# EAGLE design doorbell (EAGLE 6.6.0)
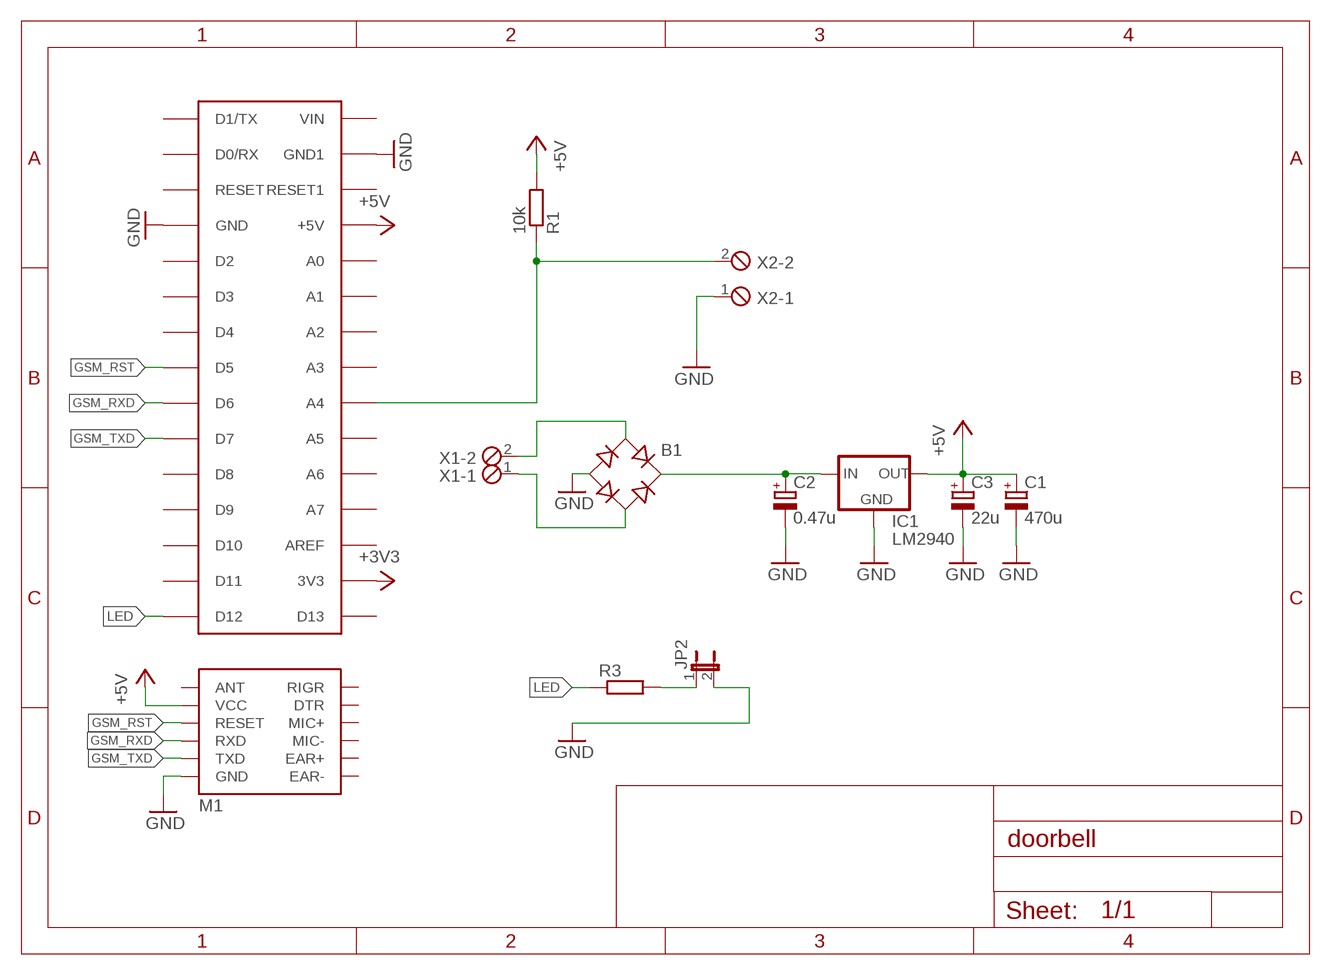
[diagram p0: schematic, sheet 1]

## Parts
B1  RB1A  [RB1A]
C1  470u  CPOL-EUE2.5-6  [E2,5-6]
C2  0.47u  CPOL-EUE2.5-5  [E2,5-5]
C3  22u  CPOL-EUE2.5-5  [E2,5-5]
IC1  LM2940  78XXS  [78XXS]
JP2  JP1E  [JP1]
M1  SIM800L  [SIM800L]
R1  10k  R-EU_0207/10  [0207/10]
R3  R-EU_0309/V  [0309V]
U$1  ARDUINONANO  [PDIP-32]
X1  MPT2  [2POL254]
X2  MPT2  [2POL254]

## Nets
+3V3: U$1.3V3
+5V: C1.+ C3.+ IC1.OUT M1.VCC R1.2 U$1.+5V
GND: B1.- C1.- C2.- C3.- IC1.GND JP2.2 M1.GND U$1.GND U$1.GND1 X2.1
GSM_RST: M1.RESET U$1.D5
GSM_RXD: M1.RXD U$1.D6
GSM_TXD: M1.TXD U$1.D7
INPUT: R1.1 U$1.A4 X2.2
LED: R3.1 U$1.D12
N$2: B1.AC1 X1.2
N$3: B1.AC2 X1.1
N$5: B1.+ C2.+ IC1.IN
N$82: JP2.1 R3.2
Unconnected: M1.ANT M1.DTR M1.EAR+ M1.EAR- M1.MIC+ M1.MIC- M1.RIGR U$1.A0 U$1.A1 U$1.A2 U$1.A3 U$1.A5 U$1.A6 U$1.A7 U$1.AREF U$1.D0/RX U$1.D1/TX U$1.D2 U$1.D3 U$1.D4 U$1.D8 U$1.D9 U$1.D10 U$1.D11 U$1.D13 U$1.RESET U$1.RESET1 U$1.VIN

## Library data of the parts
B1 = rectifier:RB1A: RECTIFIER 1 A
C1-C3 = rcl:CPOL-EU: POLARIZED CAPACITOR, European symbol
IC1 = v-reg:78XXS: VOLTAGE REGULATOR
JP2 = jumper:JP1E: JUMPER
M1 = library:SIM800L
R1 R3 = rcl:R-EU_: RESISTOR, European symbol
U$1 = rocketfarm:ARDUINONANO
X1 X2 = con-phoenix-254:MPT2: PHOENIX CONNECTOR; OC_FARNELL: unknown; OC_NEWARK: unknown

## Board
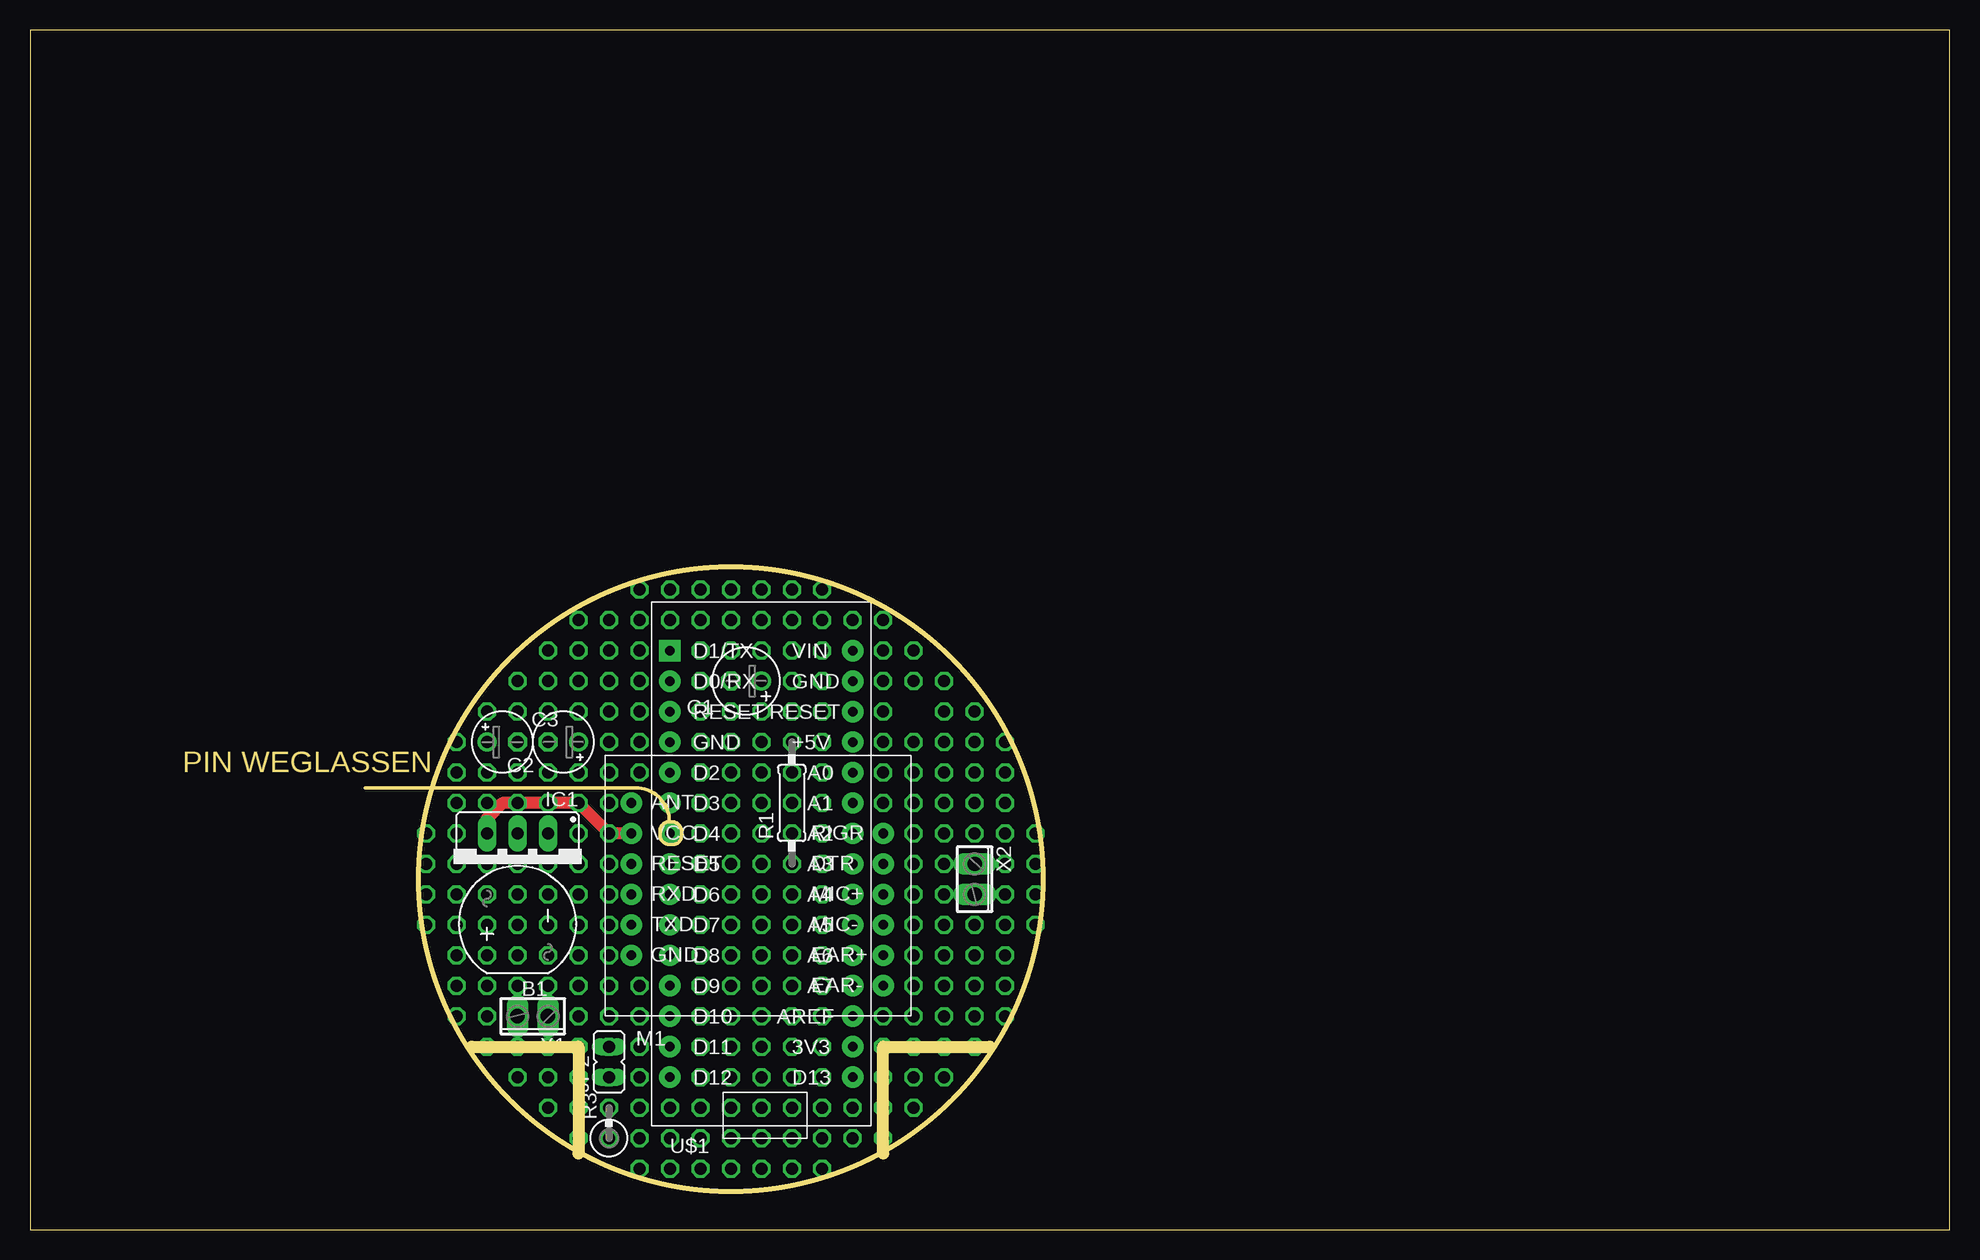
[diagram p1: board, top side]
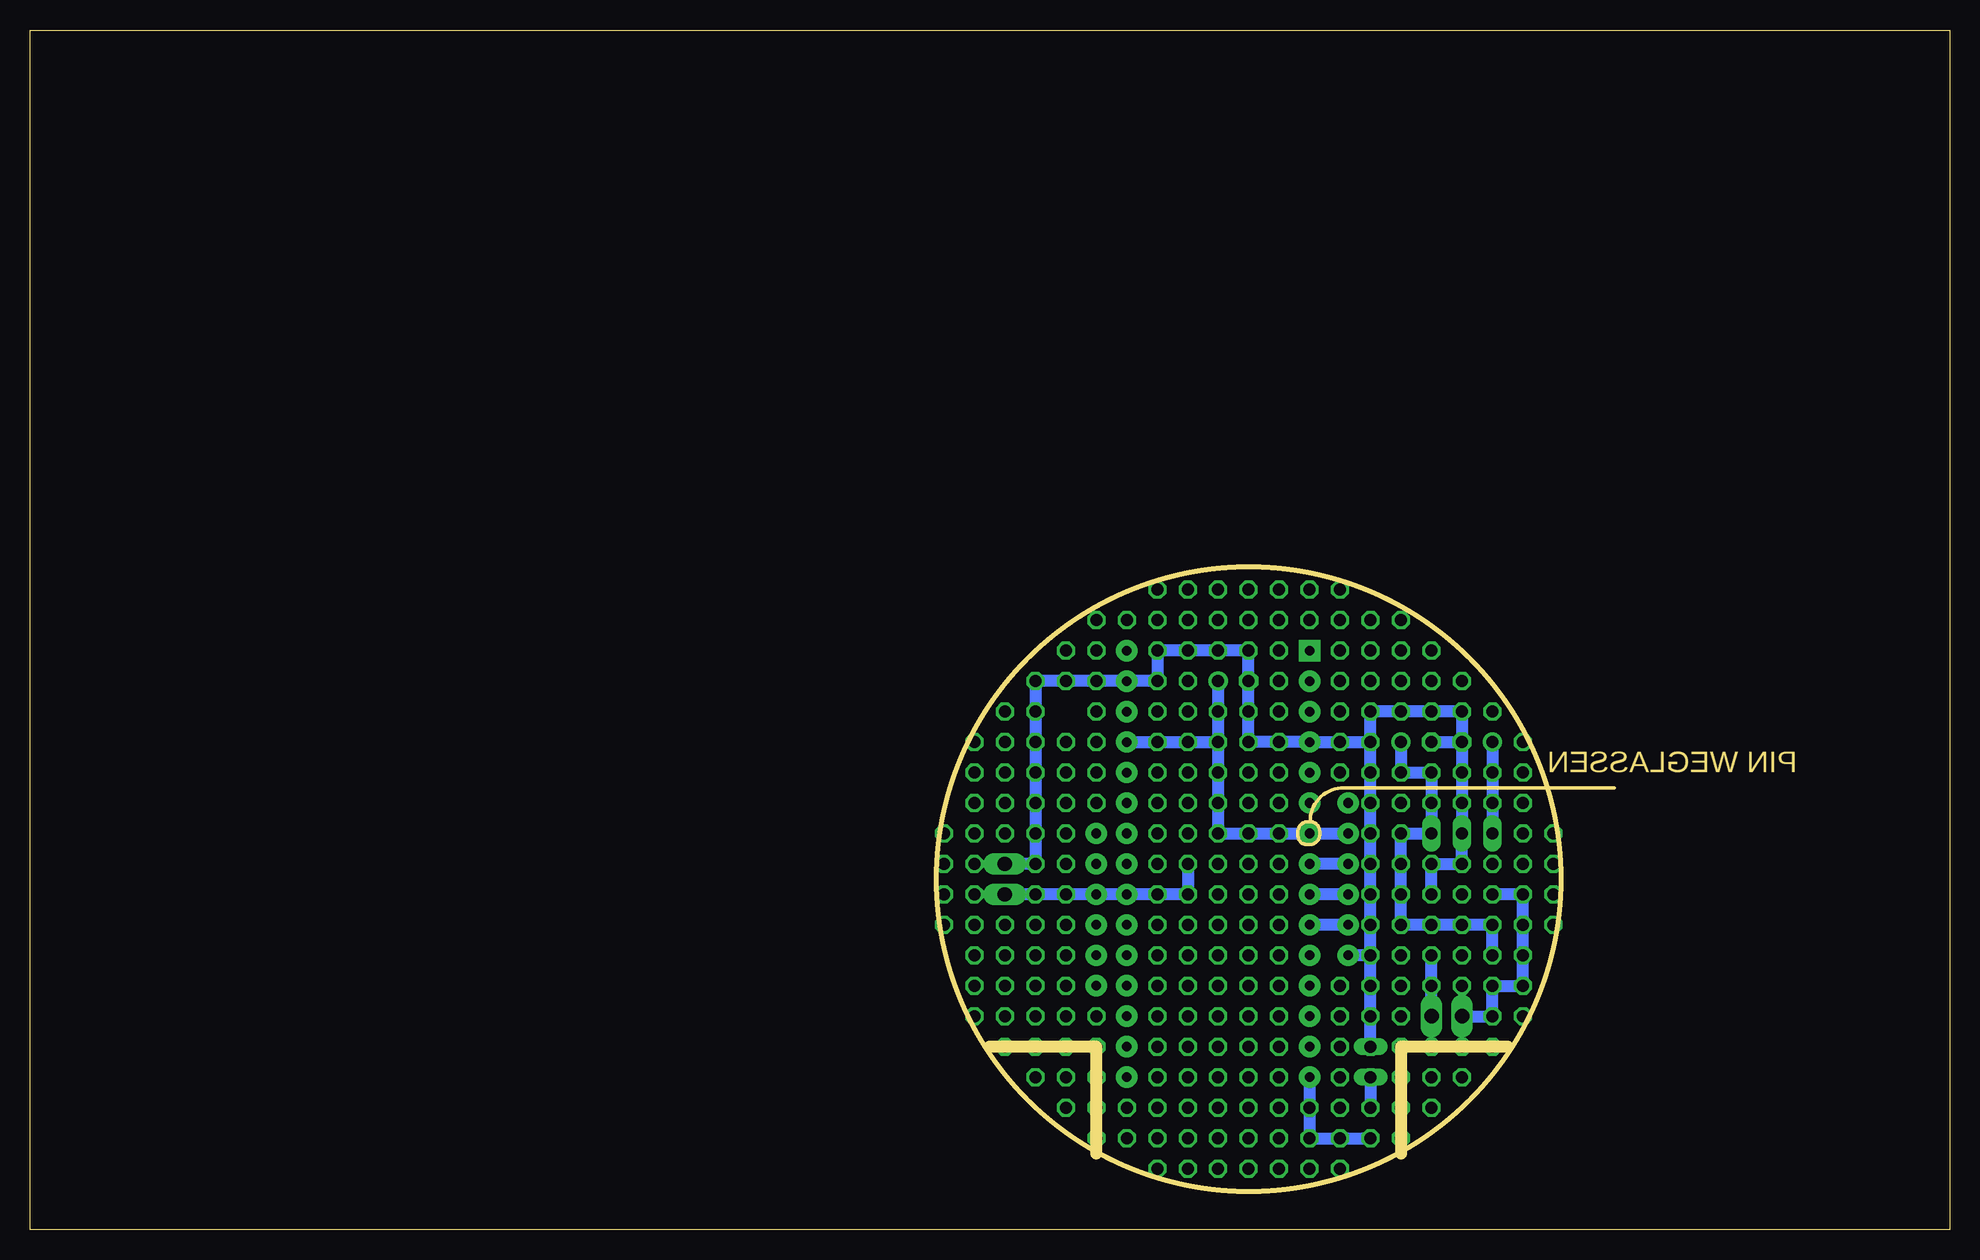
[diagram p2: board, bottom side, seen from below]

Size 160 x 100 mm. Coordinates in mm from the lower left corner, seen from the top.
Outline: 36.83,15.24 45.72,15.24 45.72,6.35
Outline: 71.12,6.35 71.12,15.24 80.01,15.24
Outline: 27.94,36.83 50.47,36.83 arc-90 53.3,34
Outline: 53.3,34 53.5,34 arc-90 54.3,33.2 54.3,32.8 arc-90 53.6,32.1 53.3,32.1 arc-90 52.5,32.9 52.5,33.2 arc-90 53.3,34
Outline: 0,0 160,0 160,100 0,100 0,0
Outline: circle at 58.42,29.21 radius 26.04
Copper layers (1*16): Top 0.035mm / dielectric 1.5mm / Bottom 0.035mm
Design rules "default": minimum track width 10mil, minimum drill 24mil, track to track 8mil, track to pad 8mil, pad to pad 8mil, via to via 8mil, smd to smd 8mil, copper to edge 40mil, drill to drill 8mil, minimum pad ring 10mil, minimum via ring 8mil, stop-mask expansion 4mil, vias tented up to drill 0mil, thermal gap 10mil

### Footprints (pad centres in the part's own frame; a part is rotated, then mirrored left to right if it is on the bottom)
RB1A = drill 1.016: + -2.54,2.54 | drill 1.016 octagon: - 2.54,-2.54; AC1 2.54,2.54; AC2 -2.54,-2.54
E2,5-6 = drill 0.813 pad 1.6: + -1.27,0 | drill 0.813 pad 1.6 octagon: - 1.27,0
E2,5-5 = drill 0.813 pad 1.6: + -1.27,0 | drill 0.813 pad 1.6 octagon: - 1.27,0
78XXS = drill 1.016 long: GND 0,-2.54; IN -2.54,-2.54; OUT 2.54,-2.54
JP1 = drill 0.914 long: 1 0,-1.27; 2 0,1.27
SIM800L = drill 0.8 pad 1.778: ANT -10.5,7.54; DTR 10.5,2.46; EAR+ 10.5,-5.16; EAR- 10.5,-7.7; GND -10.5,-5.16; MIC+ 10.5,-0.08; MIC- 10.5,-2.62; RESET -10.5,2.46; RIGR 10.5,5; RXD -10.5,-0.08; TXD -10.5,-2.62; VCC -10.5,5
0207/10 = drill 0.813 octagon: 1 -5.08,0; 2 5.08,0
0309V = drill 0.813 octagon: 1 -1.27,0; 2 1.27,0
PDIP-32 = drill 0.8 pad 1.778: 3V3 7.62,-15.24; +5V 7.62,10.16; A0 7.62,7.62; A1 7.62,5.08; A2 7.62,2.54; A3 7.62,0; A4 7.62,-2.54; A5 7.62,-5.08; A6 7.62,-7.62; A7 7.62,-10.16; AREF 7.62,-12.7; D0/RX -7.62,15.24; D2 -7.62,7.62; D3 -7.62,5.08; D4 -7.62,2.54; D5 -7.62,0; D6 -7.62,-2.54; D7 -7.62,-5.08; D8 -7.62,-7.62; D9 -7.62,-10.16; D10 -7.62,-12.7; D11 -7.62,-15.24; D12 -7.62,-17.78; D13 7.62,-17.78; GND -7.62,10.16; GND1 7.62,15.24; RESET -7.62,12.7; RESET1 7.62,12.7; VIN 7.62,17.78 | drill 0.8 pad 1.778 square: D1/TX -7.62,17.78
2POL254 = drill 1.2 long: 1 -1.27,0; 2 1.27,0

### Placement (x,y rotation side)
B1  40.64,25.4 90 top
C1  59.69,45.72 180 top
C2  44.45,40.64 180 top
C3  39.37,40.64 0 top
IC1  40.64,30.48 180 top
JP2  48.26,13.97 0 top
M1  60.63,28.02 0 top
R1  63.5,35.56 90 top
R3  48.26,8.89 90 top
U$1  60.96,30.48 0 top
X1  41.91,17.78 180 top
X2  78.74,29.21 270 top

### Tracks (layer width: path | path; a pad name or v marks a point on that pad's centre or on a via)
+5V  (via drill 1)
  Top 1.016: IC1.OUT 38.1,34.29 39.37,35.56 45.72,35.56 v48.26,33.02 M1.VCC
  Bottom 1.016: C3.+ IC1.OUT | C1.+ 60.96,40.64 | 60.96,40.64 60.96,33.02 v55.88,33.02 M1.VCC | 60.96,40.64 R1.2 U$1.+5V
GND
  Bottom 1.016: 48.26,22.86 M1.GND | C3.- IC1.GND 40.64,30.48 43.18,30.48 B1.- | JP2.2 48.26,22.86 | 48.26,22.86 48.26,40.64 | 48.26,40.64 48.26,43.18 40.64,43.18 C3.- | C2.- C3.- | X2.1 76.2,30.48 76.2,45.72 U$1.GND1 66.04,45.72 66.04,48.26 58.42,48.26 C1.- 58.42,40.64 U$1.GND 48.26,40.64
GSM_RST
  Bottom 1.016: M1.RESET U$1.D5
GSM_RXD
  Bottom 1.016: M1.RXD U$1.D6
GSM_TXD
  Bottom 1.016: M1.TXD U$1.D7
INPUT
  Bottom 1.016: R1.1 63.5,27.94 U$1.A4 X2.2
LED
  Bottom 1.016: U$1.D12 53.34,7.62 R3.1
N$1  (via drill 1)
  other vias: 38.1,15.24
N$2
  Bottom 1.016: X1.2 38.1,17.78 38.1,20.32 35.56,20.32 35.56,27.94 B1.AC1
N$3
  Bottom 1.016: X1.1 B1.AC2
N$4  (via drill 1)
  other vias: 40.64,15.24
N$5
  Bottom 1.016: C2.+ 45.72,38.1 43.18,38.1 IC1.IN 45.72,33.02 45.72,25.4 38.1,25.4 B1.+
N$6  (via drill 1)
  other vias: 43.18,15.24
N$7  (via drill 1)
  other vias: 45.72,15.24
N$8  (via drill 1)
  other vias: 48.26,15.24
N$9  (via drill 1)
  other vias: 48.26,12.7
N$10  (via drill 1)
  other vias: 45.72,12.7
N$11  (via drill 1)
  other vias: 43.18,12.7
N$12  (via drill 1)
  other vias: 40.64,12.7
N$13  (via drill 1)
  other vias: 40.64,17.78
N$14  (via drill 1)
  other vias: 43.18,17.78
N$15  (via drill 1)
  other vias: 45.72,17.78
N$16  (via drill 1)
  other vias: 38.1,17.78
N$17  (via drill 1)
  other vias: 38.1,20.32
N$18  (via drill 1)
  other vias: 40.64,20.32
N$19  (via drill 1)
  other vias: 43.18,20.32
N$20  (via drill 1)
  other vias: 45.72,20.32
N$21  (via drill 1)
  other vias: 48.26,20.32
N$22  (via drill 1)
  other vias: 48.26,17.78
N$23  (via drill 1)
  other vias: 50.8,17.78
N$24  (via drill 1)
  other vias: 50.8,15.24
N$25  (via drill 1)
  other vias: 50.8,12.7
N$26  (via drill 1)
  other vias: 50.8,20.32
N$27  (via drill 1)
  other vias: 48.26,22.86
N$28  (via drill 1)
  other vias: 45.72,22.86
N$29  (via drill 1)
  other vias: 43.18,22.86
N$30  (via drill 1)
  other vias: 40.64,22.86
N$31  (via drill 1)
  other vias: 38.1,22.86
N$32  (via drill 1)
  other vias: 35.56,22.86
N$33  (via drill 1)
  other vias: 35.56,20.32
N$34  (via drill 1)
  other vias: 35.56,25.4
N$35  (via drill 1)
  other vias: 38.1,25.4
N$36  (via drill 1)
  other vias: 40.64,25.4
N$37  (via drill 1)
  other vias: 43.18,25.4
N$38  (via drill 1)
  other vias: 45.72,25.4
N$39  (via drill 1)
  other vias: 48.26,25.4
N$40  (via drill 1)
  other vias: 48.26,27.94
N$41  (via drill 1)
  other vias: 45.72,27.94
N$42  (via drill 1)
  other vias: 43.18,27.94
N$43  (via drill 1)
  other vias: 40.64,27.94
N$44  (via drill 1)
  other vias: 38.1,27.94
N$45  (via drill 1)
  other vias: 35.56,27.94
N$46  (via drill 1)
  other vias: 35.56,30.48
N$47  (via drill 1)
  other vias: 38.1,30.48
N$48  (via drill 1)
  other vias: 40.64,30.48
N$49  (via drill 1)
  other vias: 43.18,30.48
N$50  (via drill 1)
  other vias: 45.72,30.48
N$51  (via drill 1)
  other vias: 48.26,30.48
N$52  (via drill 1)
  other vias: 35.56,33.02
N$53  (via drill 1)
  other vias: 38.1,33.02
N$54  (via drill 1)
  other vias: 40.64,33.02
N$55  (via drill 1)
  other vias: 43.18,33.02
N$56  (via drill 1)
  other vias: 45.72,33.02
N$57  (via drill 1)
  other vias: 45.72,35.56
N$58  (via drill 1)
  other vias: 43.18,35.56
N$59  (via drill 1)
  other vias: 40.64,35.56
N$60  (via drill 1)
  other vias: 38.1,35.56
N$61  (via drill 1)
  other vias: 35.56,35.56
N$62  (via drill 1)
  other vias: 35.56,38.1
N$63  (via drill 1)
  other vias: 38.1,38.1
N$64  (via drill 1)
  other vias: 40.64,38.1
N$65  (via drill 1)
  other vias: 43.18,38.1
N$66  (via drill 1)
  other vias: 45.72,38.1
N$67  (via drill 1)
  other vias: 35.56,40.64
N$68  (via drill 1)
  other vias: 38.1,40.64
N$69  (via drill 1)
  other vias: 40.64,40.64
N$70  (via drill 1)
  other vias: 43.18,40.64
N$71  (via drill 1)
  other vias: 45.72,40.64
N$72  (via drill 1)
  other vias: 45.72,43.18
N$73  (via drill 1)
  other vias: 43.18,43.18
N$74  (via drill 1)
  other vias: 40.64,43.18
N$75  (via drill 1)
  other vias: 38.1,43.18
N$76  (via drill 1)
  other vias: 55.88,15.24
N$77  (via drill 1)
  other vias: 58.42,7.62
N$79  (via drill 1)
  other vias: 40.64,45.72
N$80  (via drill 1)
  other vias: 43.18,45.72
N$81  (via drill 1)
  other vias: 45.72,45.72
N$82
  Bottom 1.016: JP2.1 R3.2
N$83  (via drill 1)
  other vias: 43.18,48.26
N$84  (via drill 1)
  other vias: 45.72,48.26
N$85  (via drill 1)
  other vias: 48.26,48.26
N$86  (via drill 1)
  other vias: 50.8,48.26
N$87  (via drill 1)
  other vias: 50.8,50.8
N$88  (via drill 1)
  other vias: 48.26,50.8
N$89  (via drill 1)
  other vias: 45.72,50.8
N$96  (via drill 1)
  other vias: 50.8,53.34
N$97  (via drill 1)
  other vias: 53.34,50.8
N$98  (via drill 1)
  other vias: 55.88,50.8
N$99  (via drill 1)
  other vias: 58.42,50.8
N$100  (via drill 1)
  other vias: 60.96,50.8
N$101  (via drill 1)
  other vias: 63.5,50.8
N$102  (via drill 1)
  other vias: 63.5,53.34
N$103  (via drill 1)
  other vias: 60.96,53.34
N$104  (via drill 1)
  other vias: 58.42,53.34
N$105  (via drill 1)
  other vias: 55.88,53.34
N$106  (via drill 1)
  other vias: 53.34,53.34
N$113  (via drill 1)
  other vias: 78.74,15.24
N$114  (via drill 1)
  other vias: 76.2,15.24
N$115  (via drill 1)
  other vias: 73.66,15.24
N$116  (via drill 1)
  other vias: 71.12,15.24
N$117  (via drill 1)
  other vias: 71.12,12.7
N$118  (via drill 1)
  other vias: 73.66,12.7
N$119  (via drill 1)
  other vias: 76.2,12.7
N$121  (via drill 1)
  other vias: 78.74,17.78
N$122  (via drill 1)
  other vias: 76.2,17.78
N$123  (via drill 1)
  other vias: 73.66,17.78
N$124  (via drill 1)
  other vias: 81.28,17.78
N$125  (via drill 1)
  other vias: 81.28,20.32
N$126  (via drill 1)
  other vias: 78.74,20.32
N$127  (via drill 1)
  other vias: 76.2,20.32
N$128  (via drill 1)
  other vias: 73.66,20.32
N$130  (via drill 1)
  other vias: 71.12,17.78
N$132  (via drill 1)
  other vias: 73.66,22.86 73.66,25.4 76.2,25.4 73.66,38.1
N$133  (via drill 1)
  other vias: 76.2,22.86
N$134  (via drill 1)
  other vias: 78.74,22.86
N$135  (via drill 1)
  other vias: 81.28,22.86
N$138  (via drill 1)
  other vias: 83.82,25.4
N$139  (via drill 1)
  other vias: 81.28,25.4
N$140  (via drill 1)
  other vias: 78.74,25.4
N$145  (via drill 1)
  other vias: 73.66,27.94
N$146  (via drill 1)
  other vias: 76.2,27.94
N$147  (via drill 1)
  other vias: 78.74,27.94
N$148  (via drill 1)
  other vias: 81.28,27.94
N$149  (via drill 1)
  other vias: 83.82,27.94
N$150  (via drill 1)
  other vias: 83.82,30.48
N$151  (via drill 1)
  other vias: 81.28,30.48
N$152  (via drill 1)
  other vias: 78.74,30.48
N$153  (via drill 1)
  other vias: 76.2,30.48
N$154  (via drill 1)
  other vias: 73.66,30.48
N$156  (via drill 1)
  other vias: 83.82,33.02
N$157  (via drill 1)
  other vias: 81.28,33.02
N$158  (via drill 1)
  other vias: 78.74,33.02
N$159  (via drill 1)
  other vias: 76.2,33.02
N$160  (via drill 1)
  other vias: 73.66,33.02
N$161  (via drill 1)
  other vias: 73.66,35.56
N$162  (via drill 1)
  other vias: 76.2,35.56
N$163  (via drill 1)
  other vias: 78.74,35.56
N$164  (via drill 1)
  other vias: 81.28,35.56
N$167  (via drill 1)
  other vias: 81.28,38.1
N$168  (via drill 1)
  other vias: 78.74,38.1
N$169  (via drill 1)
  other vias: 76.2,38.1
N$172  (via drill 1)
  other vias: 81.28,40.64
N$173  (via drill 1)
  other vias: 78.74,40.64
N$174  (via drill 1)
  other vias: 76.2,40.64
N$175  (via drill 1)
  other vias: 73.66,40.64
N$177  (via drill 1)
  other vias: 76.2,43.18
N$178  (via drill 1)
  other vias: 78.74,43.18
N$184  (via drill 1)
  other vias: 76.2,45.72
N$185  (via drill 1)
  other vias: 73.66,45.72
N$188  (via drill 1)
  other vias: 73.66,48.26
N$189  (via drill 1)
  other vias: 71.12,48.26
N$190  (via drill 1)
  other vias: 71.12,50.8
N$198  (via drill 1)
  other vias: 71.12,35.56
N$199  (via drill 1)
  other vias: 71.12,38.1
N$200  (via drill 1)
  other vias: 71.12,40.64
N$201  (via drill 1)
  other vias: 71.12,45.72
N$202  (via drill 1)
  other vias: 71.12,43.18
N$203  (via drill 1)
  other vias: 50.8,45.72
N$204  (via drill 1)
  other vias: 48.26,45.72
N$205  (via drill 1)
  other vias: 48.26,43.18
N$206  (via drill 1)
  other vias: 50.8,43.18
N$207  (via drill 1)
  other vias: 50.8,40.64
N$208  (via drill 1)
  other vias: 48.26,40.64
N$209  (via drill 1)
  other vias: 48.26,38.1
N$210  (via drill 1)
  other vias: 50.8,38.1
N$211  (via drill 1)
  other vias: 48.26,35.56
N$213  (via drill 1)
  other vias: 66.04,53.34
N$215  (via drill 1)
  other vias: 68.58,50.8
N$216  (via drill 1)
  other vias: 66.04,50.8
N$217  (via drill 1)
  other vias: 71.12,10.16
N$218  (via drill 1)
  other vias: 73.66,10.16
N$219  (via drill 1)
  other vias: 66.04,10.16
N$220  (via drill 1)
  other vias: 68.58,10.16
N$221  (via drill 1)
  other vias: 63.5,10.16
N$222  (via drill 1)
  other vias: 60.96,10.16
N$223  (via drill 1)
  other vias: 58.42,10.16
N$224  (via drill 1)
  other vias: 55.88,10.16
N$225  (via drill 1)
  other vias: 60.96,7.62
N$226  (via drill 1)
  other vias: 63.5,7.62
N$227  (via drill 1)
  other vias: 66.04,7.62
N$228  (via drill 1)
  other vias: 68.58,7.62
N$229  (via drill 1)
  other vias: 63.5,5.08
N$230  (via drill 1)
  other vias: 66.04,5.08
N$231  (via drill 1)
  other vias: 60.96,5.08
N$232  (via drill 1)
  other vias: 58.42,5.08
N$233  (via drill 1)
  other vias: 55.88,5.08
N$234  (via drill 1)
  other vias: 53.34,5.08
N$235  (via drill 1)
  other vias: 53.34,7.62
N$236  (via drill 1)
  other vias: 55.88,7.62
N$237  (via drill 1)
  other vias: 53.34,10.16
N$238  (via drill 1)
  other vias: 50.8,10.16
N$239  (via drill 1)
  other vias: 50.8,7.62
N$240  (via drill 1)
  other vias: 50.8,5.08
N$241  (via drill 1)
  other vias: 48.26,7.62
N$242  (via drill 1)
  other vias: 48.26,10.16
N$243  (via drill 1)
  other vias: 43.18,10.16
N$244  (via drill 1)
  other vias: 45.72,10.16
N$245  (via drill 1)
  other vias: 45.72,7.62
N$246  (via drill 1)
  other vias: 35.56,17.78
N$247  (via drill 1)
  other vias: 33.02,30.48
N$248  (via drill 1)
  other vias: 33.02,27.94
N$249  (via drill 1)
  other vias: 33.02,25.4
N$251  (via drill 1)
  other vias: 33.02,33.02
N$255  (via drill 1)
  other vias: 71.12,7.62
N$273  (via drill 1)
  other vias: 55.88,12.7
N$274  (via drill 1)
  other vias: 58.42,12.7
N$275  (via drill 1)
  other vias: 60.96,12.7
N$276  (via drill 1)
  other vias: 63.5,12.7
N$277  (via drill 1)
  other vias: 66.04,12.7
N$278  (via drill 1)
  other vias: 66.04,15.24
N$279  (via drill 1)
  other vias: 63.5,15.24
N$280  (via drill 1)
  other vias: 60.96,15.24
N$281  (via drill 1)
  other vias: 58.42,15.24
N$282  (via drill 1)
  other vias: 55.88,17.78
N$283  (via drill 1)
  other vias: 58.42,17.78
N$284  (via drill 1)
  other vias: 60.96,17.78
N$285  (via drill 1)
  other vias: 63.5,17.78
N$286  (via drill 1)
  other vias: 66.04,17.78
N$287  (via drill 1)
  other vias: 66.04,20.32
N$288  (via drill 1)
  other vias: 63.5,20.32
N$289  (via drill 1)
  other vias: 60.96,20.32
N$290  (via drill 1)
  other vias: 58.42,20.32
N$291  (via drill 1)
  other vias: 55.88,20.32
N$292  (via drill 1)
  other vias: 55.88,22.86
N$293  (via drill 1)
  other vias: 58.42,22.86
N$294  (via drill 1)
  other vias: 60.96,22.86
N$295  (via drill 1)
  other vias: 63.5,22.86
N$296  (via drill 1)
  other vias: 66.04,22.86
N$297  (via drill 1)
  other vias: 66.04,25.4
N$298  (via drill 1)
  other vias: 63.5,25.4
N$299  (via drill 1)
  other vias: 60.96,25.4
N$300  (via drill 1)
  other vias: 58.42,25.4
N$301  (via drill 1)
  other vias: 55.88,27.94
N$302  (via drill 1)
  other vias: 58.42,27.94
N$303  (via drill 1)
  other vias: 60.96,27.94
N$304  (via drill 1)
  other vias: 63.5,27.94
N$305  (via drill 1)
  other vias: 66.04,27.94
N$306  (via drill 1)
  other vias: 66.04,30.48
N$307  (via drill 1)
  other vias: 63.5,30.48
N$308  (via drill 1)
  other vias: 60.96,30.48
N$309  (via drill 1)
  other vias: 58.42,30.48
N$310  (via drill 1)
  other vias: 55.88,30.48
N$311  (via drill 1)
  other vias: 55.88,25.4
N$313  (via drill 1)
  other vias: 58.42,33.02
N$314  (via drill 1)
  other vias: 60.96,33.02
N$315  (via drill 1)
  other vias: 63.5,33.02
N$316  (via drill 1)
  other vias: 66.04,33.02
N$317  (via drill 1)
  other vias: 66.04,35.56
N$318  (via drill 1)
  other vias: 63.5,35.56
N$319  (via drill 1)
  other vias: 60.96,35.56
N$320  (via drill 1)
  other vias: 58.42,35.56
N$321  (via drill 1)
  other vias: 55.88,35.56
N$322  (via drill 1)
  other vias: 55.88,38.1
N$323  (via drill 1)
  other vias: 58.42,38.1
N$324  (via drill 1)
  other vias: 60.96,38.1
N$325  (via drill 1)
  other vias: 63.5,38.1
N$326  (via drill 1)
  other vias: 63.5,40.64
N$327  (via drill 1)
  other vias: 60.96,40.64
N$328  (via drill 1)
  other vias: 58.42,40.64
N$329  (via drill 1)
  other vias: 55.88,40.64
N$330  (via drill 1)
  other vias: 55.88,43.18
N$331  (via drill 1)
  other vias: 58.42,43.18
N$332  (via drill 1)
  other vias: 60.96,43.18
N$333  (via drill 1)
  other vias: 63.5,43.18
N$334  (via drill 1)
  other vias: 66.04,43.18
N$335  (via drill 1)
  other vias: 66.04,45.72
N$336  (via drill 1)
  other vias: 63.5,45.72
N$337  (via drill 1)
  other vias: 60.96,45.72
N$338  (via drill 1)
  other vias: 58.42,45.72
N$339  (via drill 1)
  other vias: 55.88,45.72
N$340  (via drill 1)
  other vias: 55.88,48.26
N$341  (via drill 1)
  other vias: 58.42,48.26
N$342  (via drill 1)
  other vias: 60.96,48.26
N$343  (via drill 1)
  other vias: 63.5,48.26
N$344  (via drill 1)
  other vias: 66.04,48.26
N$345  (via drill 1)
  other vias: 66.04,40.64
N$346  (via drill 1)
  other vias: 66.04,38.1

### Text on the board
Dimension: PIN WEGLASSEN